# EAGLE design Bodenplatine (EAGLE 5.11)
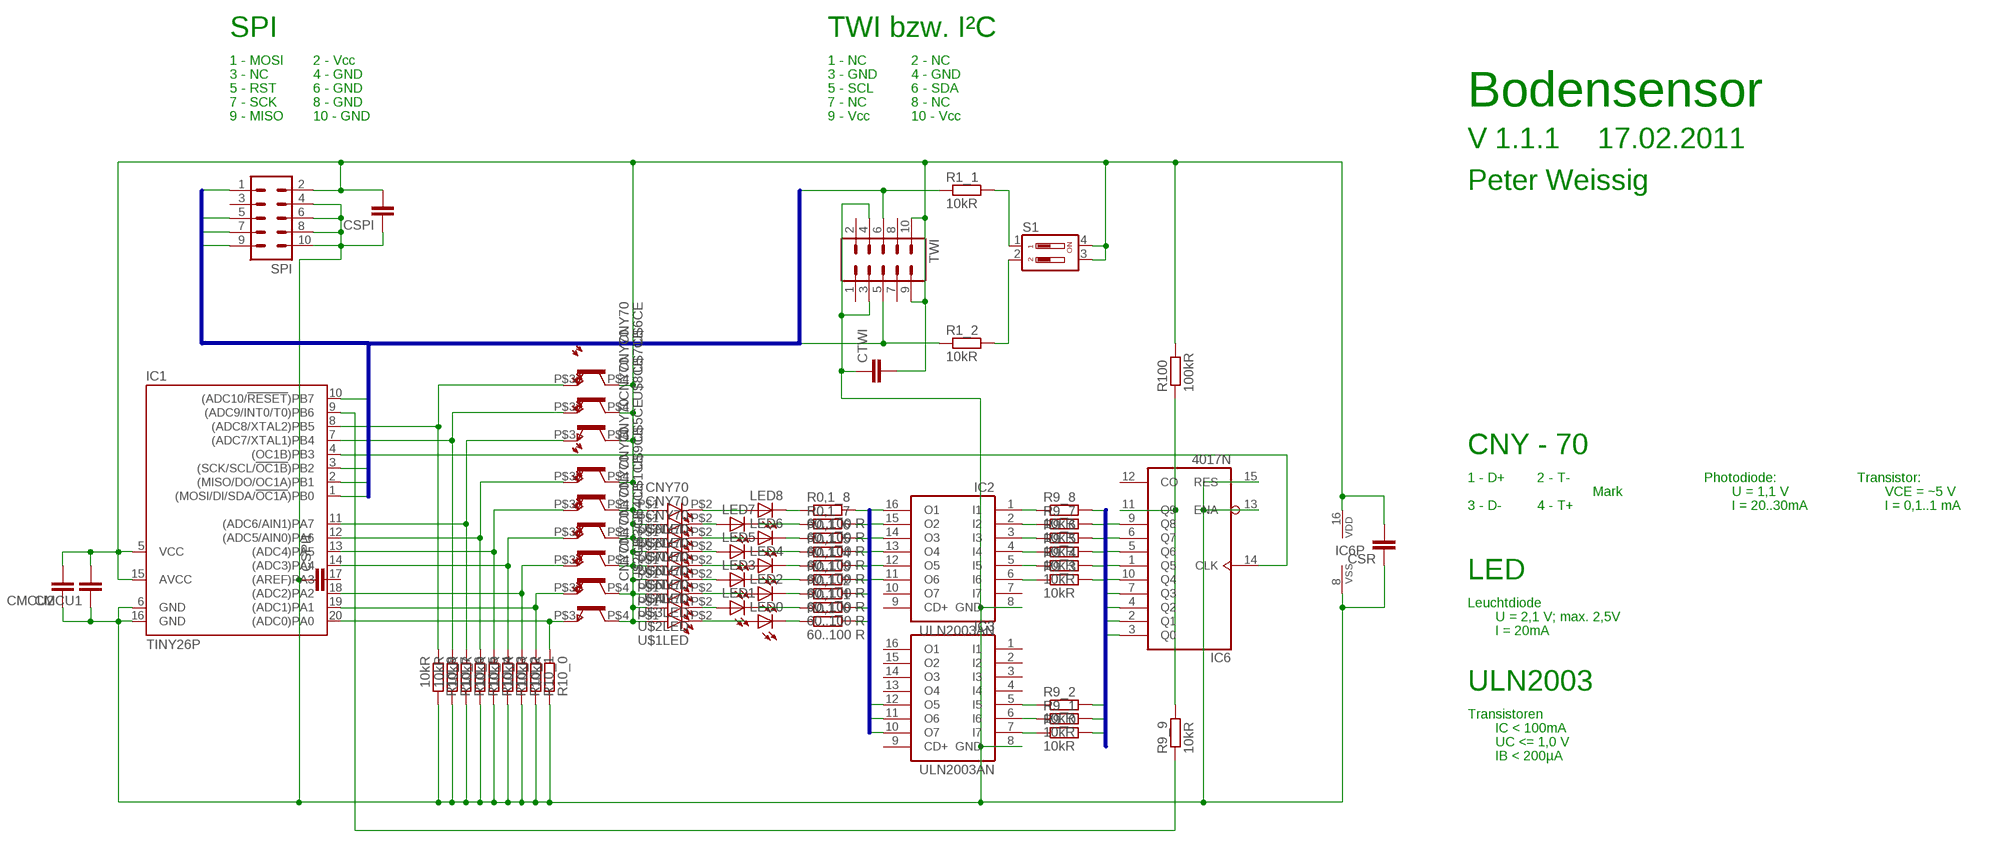
[diagram p0: schematic, sheet 1]

## Parts
CMCU1  C-EU025-025X050  [C025-025X050]
CMCU2  C-EU025-025X050  [C025-025X050]
CSPI  C-EU025-025X050  [C025-025X050]
CSPI1  C-EU025-025X050  [C025-025X050]
CSR  C-EU025-025X050  [C025-025X050]
CTWI  C-EU025-025X050  [C025-025X050]
IC1  TINY26P  [DIL20]
IC2  ULN2003AN  [DIL16]
IC3  ULN2003AN  [DIL16]
IC6  4017N  [DIL16]
LED0  LED3MM  [LED3MM]
LED1  LED3MM  [LED3MM]
LED2  LED3MM  [LED3MM]
LED3  LED3MM  [LED3MM]
LED4  LED3MM  [LED3MM]
LED5  LED3MM  [LED3MM]
LED6  LED3MM  [LED3MM]
LED7  LED3MM  [LED3MM]
LED8  LED3MM  [LED3MM]
R0,1_0  60..100 R  R-EU_0207/10  [0207/10]
R0,1_1  60..100 R  R-EU_0207/10  [0207/10]
R0,1_2  60..100 R  R-EU_0207/10  [0207/10]
R0,1_3  60..100 R  R-EU_0207/10  [0207/10]
R0,1_4  60..100 R  R-EU_0207/10  [0207/10]
R0,1_5  60..100 R  R-EU_0207/10  [0207/10]
R0,1_6  60..100 R  R-EU_0207/10  [0207/10]
R0,1_7  60..100 R  R-EU_0207/10  [0207/10]
R0,1_8  60..100 R  R-EU_0207/10  [0207/10]
R1_1  10kR  R-EU_R1206  [R1206]
R1_2  10kR  R-EU_R1206  [R1206]
R9_0  10kR  R-EU_R1206  [R1206]
R9_1  10kR  R-EU_R1206  [R1206]
R9_2  10kR  R-EU_R1206  [R1206]
R9_3  10kR  R-EU_R1206  [R1206]
R9_4  10kR  R-EU_R1206  [R1206]
R9_5  10kR  R-EU_R1206  [R1206]
R9_6  10kR  R-EU_R1206  [R1206]
R9_7  10kR  R-EU_R1206  [R1206]
R9_8  10kR  R-EU_R1206  [R1206]
R9_9  10kR  R-EU_R1206  [R1206]
R10_0  10kR  R-EU_R1206  [R1206]
R10_1  10kR  R-EU_R1206  [R1206]
R10_2  10kR  R-EU_R1206  [R1206]
R10_3  10kR  R-EU_0207/10  [0207/10]
R10_4  10kR  R-EU_0207/10  [0207/10]
R10_5  10kR  R-EU_0207/10  [0207/10]
R10_6  10kR  R-EU_R1206  [R1206]
R10_7  10kR  R-EU_R1206  [R1206]
R10_8  10kR  R-EU_R1206  [R1206]
R100  100kR  R-EU_R1206  [R1206]
S1  DIP02YL  [DIP02YL]
SPI  ML10  [ML10]
TWI  ML10  [ML10]
U$1  CNY70  [CNY70]
U$2  CNY70  [CNY70]
U$3  CNY70  [CNY70]
U$4  CNY70  [CNY70]
U$5  CNY70  [CNY70]
U$6  CNY70  [CNY70]
U$7  CNY70  [CNY70]
U$8  CNY70  [CNY70]
U$9  CNY70  [CNY70]

## Nets
B4017D0: IC6.3(Q0) R9_4.2
B4017D1: IC6.2(Q1) R9_3.2
B4017D2: IC6.4(Q2) R9_5.2
B4017D3: IC6.7(Q3) R9_8.2
B4017D4: IC6.10(Q4) R9_1.2
B4017D5: IC6.1(Q5) R9_2.2
B4017D6: IC6.5(Q6) R9_6.2
B4017D7: IC6.6(Q7) R9_7.2
B4017D8: IC6.9(Q8) R9_0.2
BSPI0: IC1.1((MOSI/DI/SDA/!OC1A!)PB0) R1_1.1 SPI.1 TWI.6
BSPI1: IC1.10((ADC10/!RESET!)PB7) SPI.5
BSPI2: IC1.3((SCK/SCL/!OC1B!)PB2) R1_2.1 SPI.7 TWI.5
BSPI3: IC1.2((MISO/DO/OC1A)PB1) SPI.9
BULN0: IC2.12(O5) R0,1_0.2
BULN1: IC2.11(O6) R0,1_1.2
BULN2: IC2.13(O4) R0,1_2.2
BULN3: IC2.16(O1) R0,1_3.2
BULN4: IC3.11(O6) R0,1_4.2
BULN5: IC3.12(O5) R0,1_5.2
BULN6: IC2.14(O3) R0,1_6.2
BULN7: IC2.15(O2) R0,1_7.2
BULN8: IC3.10(O7) R0,1_8.2
GND: CMCU1.1 CMCU2.1 CSPI1.1 CSPI.1 CSR.1 CTWI.1 IC1.6(GND) IC1.16(GND) IC2.8(GND) IC3.8(GND) IC6.8(VSS) IC6.13(ENA) IC6.15(RES) R10_0.2 R10_1.2 R10_2.2 R10_3.2 R10_4.2 R10_5.2 R10_6.2 R10_7.2 R10_8.2 SPI.4 SPI.6 SPI.8 SPI.10 TWI.3 TWI.4
N$1: IC1.20((ADC0)PA0) R10_0.1 U$2.P$3(CE:E)
N$2: LED0.A U$1.P$2(LED:K)
N$3: LED0.K(C) R0,1_0.1
N$4: LED8.A U$9.P$2(LED:K)
N$5: IC1.19((ADC1)PA1) R10_1.1 U$3.P$3(CE:E)
N$6: LED1.A U$2.P$2(LED:K)
N$7: LED1.K(C) R0,1_1.1
N$8: IC1.8((ADC8/XTAL2)PB5) R10_8.1 U$6.P$3(CE:E)
N$9: LED8.K(C) R0,1_8.1
N$10: IC3.5(I5) R9_2.1
N$11: IC1.12((ADC5/AIN0)PA6) R10_5.1 U$5.P$3(CE:E)
N$12: LED2.A U$3.P$2(LED:K)
N$13: LED2.K(C) R0,1_2.1
N$14: IC3.6(I6) R9_1.1
N$15: IC1.18((ADC2)PA2) R10_2.1 U$4.P$3(CE:E)
N$16: LED3.A U$4.P$2(LED:K)
N$17: LED3.K(C) R0,1_3.1
N$18: IC3.7(I7) R9_0.1
N$19: IC1.14((ADC3)PA4) R10_3.1 U$1.P$3(CE:E)
N$20: IC1.13((ADC4)PA5) R10_4.1 U$9.P$3(CE:E)
N$21: LED4.A U$5.P$2(LED:K)
N$22: LED4.K(C) R0,1_4.1
N$23: IC1.11((ADC6/AIN1)PA7) R10_6.1 U$8.P$3(CE:E)
N$24: LED5.A U$6.P$2(LED:K)
N$25: LED5.K(C) R0,1_5.1
N$26: CSPI1.2 IC1.17((AREF)PA3)
N$27: IC1.7((ADC7/XTAL1)PB4) R10_7.1 U$7.P$3(CE:E)
N$28: LED6.A U$7.P$2(LED:K)
N$29: LED6.K(C) R0,1_6.1
N$32: LED7.A U$8.P$2(LED:K)
N$33: LED7.K(C) R0,1_7.1
N$34: IC2.6(I6) R9_3.1
N$35: IC2.5(I5) R9_4.1
N$36: IC2.4(I4) R9_5.1
N$37: IC2.3(I3) R9_6.1
N$38: IC2.2(I2) R9_7.1
N$39: IC2.1(I1) R9_8.1
N$43: IC1.4((OC1B)PB3) IC6.14(CLK)
N$44: IC1.9((ADC9/INT0/T0)PB6) R9_9.1
N$57: IC6.11(Q9) R9_9.2 R100.1
N$58: R1_1.2 S1.1
N$59: R1_2.2 S1.2
VCC: CMCU1.2 CMCU2.2 CSPI.2 CSR.2 CTWI.2 IC1.5(VCC) IC1.15(AVCC) IC6.16(VDD) R100.2 S1.3 S1.4 SPI.2 TWI.9 TWI.10 U$1.P$1(LED:A) U$1.P$4(CE:C) U$2.P$1(LED:A) U$2.P$4(CE:C) U$3.P$1(LED:A) U$3.P$4(CE:C) U$4.P$1(LED:A) U$4.P$4(CE:C) U$5.P$1(LED:A) U$5.P$4(CE:C) U$6.P$1(LED:A) U$6.P$4(CE:C) U$7.P$1(LED:A) U$7.P$4(CE:C) U$8.P$1(LED:A) U$8.P$4(CE:C) U$9.P$1(LED:A) U$9.P$4(CE:C)
Unconnected: IC2.7(I7) IC2.9(CD+) IC2.10(O7) IC3.1(I1) IC3.2(I2) IC3.3(I3) IC3.4(I4) IC3.9(CD+) IC3.13(O4) IC3.14(O3) IC3.15(O2) IC3.16(O1) IC6.12(CO) SPI.3 TWI.1 TWI.2 TWI.7 TWI.8

## Buses
BSPI[0..3]
BULN[0..8]
B4017D[0..8]

## Notes on the sheet
- SPI | TWI bzw. I²C
- 1 - MOSI | 2 - Vcc | 1 - NC | 2 - NC
- 3 - NC | 4 - GND | 3 - GND | 4 - GND
- 5 - RST | 6 - GND | 5 - SCL | 6 - SDA
- 7 - SCK | 8 - GND | 7 - NC | 8 - NC | Bodensensor
- 9 - MISO | 10 - GND | 9 - Vcc | 10 - Vcc
- V 1.1.1 | 17.02.2011
- Peter Weissig
- CNY - 70
- 1 - D+ | 2 - T- | Photodiode: | Transistor:
- Mark | U = 1,1 V | VCE = ~5 V
- 3 - D- | 4 - T+ | I = 20..30mA | I = 0,1..1 mA
- LED
- Leuchtdiode
- U = 2,1 V; max. 2,5V
- I = 20mA
- ULN2003
- Transistoren
- IC < 100mA
- UC <= 1,0 V
- IB < 200µA

## Library data of the parts
CMCU1 CMCU2 CSPI CSPI1 CSR CTWI = rcl:C-EU: CAPACITOR, European symbol
IC1 = atmel:TINY26*: 8-bit AVR Microcontroller with 2K Bytes Flash Source: http://www.atmel.com .. doc1477.pdf
IC2 IC3 = uln-udn:ULN2003A: DRIVER ARRAY
IC6 = 40xx:4017: COUNTER/DIVIDER
LED0 LED1-LED8 = led:LED: LED OSRAM: - CHIPLED LG R971, LG N971, LY N971, LG Q971, LY Q971, LO R971, LY R971 LH N974, LH R974 LS Q976, LO Q976, LY Q976 LO Q996 - Hyper CHIPLED LW Q18S LB Q993, LB Q99A, LB R99A - SideLED LS A670, LO A670, LY A670, LG A670, LP A670 LB A673, LV A673, LT A673, LW A673 LH A674 LY A675 LS A676, LA A676, LO A676, LY A676, LW A676 LS A679, LY A679, LG A679 - Hyper Micro SIDELED® LS Y876, LA Y876, LO Y876, LY Y876 LT Y87S - SmartLED LW L88C, LW L88S LB L89C, LB L89S, LG L890 LS L89K, LO L89K, LY L89K LS L896, LA L896, LO L896, LY L896 - TOPLED LS T670, LO T670, LY T670, LG T670, LP T670 LSG T670, LSP T670, LSY T670, LOP T670, LYG T670 LG T671, LOG T671, LSG T671 LB T673, LV T673, LT T673, LW T673 LH T674 LS T676, LA T676, LO T676, LY T676, LB T676, LH T676, LSB T676, LW T676 LB T67C, LV T67C, LT T67C, LS T67K, LO T67K, LY T67K, LW E67C LS E67B, LA E67B, LO E67B, LY E67B, LB E67C, LV E67C, LT E67C LW T67C LS T679, LY T679, LG T679 LS T770, LO T770, LY T770, LG T770, LP T770 LB T773, LV T773, LT T773, LW T773 LH T774 LS E675, LA E675, LY E675, LS T675 LS T776, LA T776, LO T776, LY T776, LB T776 LHGB T686 LT T68C, LB T68C - Hyper Mini TOPLED® LB M676 - Mini TOPLED Santana® LG M470 LS M47K, LO M47K, LY M47K Source: http://www.osram.convergy.de LUXEON: - LUMILED® LXK2-PW12-R00, LXK2-PW12-S00, LXK2-PW14-U00, LXK2-PW14-V00 LXK2-PM12-R00, LXK2-PM12-S00, LXK2-PM14-U00 LXK2-PE12-Q00, LXK2-PE12-R00, LXK2-PE12-S00, LXK2-PE14-T00, LXK2-PE14-U00 LXK2-PB12-K00, LXK2-PB12-L00, LXK2-PB12-M00, LXK2-PB14-N00, LXK2-PB14-P00, LXK2-PB14-Q00 LXK2-PR12-L00, LXK2-PR12-M00, LXK2-PR14-Q00, LXK2-PR14-R00 LXK2-PD12-Q00, LXK2-PD12-R00, LXK2-PD12-S00 LXK2-PH12-R00, LXK2-PH12-S00 LXK2-PL12-P00, LXK2-PL12-Q00, LXK2-PL12-R00 Source: www.luxeon.com KINGBRIGHT: KA-3528ASYC Source: www.kingbright.com
R0,1_0 R0,1_1-R0,1_8 R1_1 R1_2 R9_0 R9_1-R9_9 R10_0 R10_1-R10_8 R100 = rcl:R-EU_: RESISTOR, European symbol
S1 = switch-dil:DIP02YL: DIL/CODE SWITCH
SPI TWI = con-harting-ml:ML10: HARTING
U$1-U$9 = optocoupler:CNY70

## Board
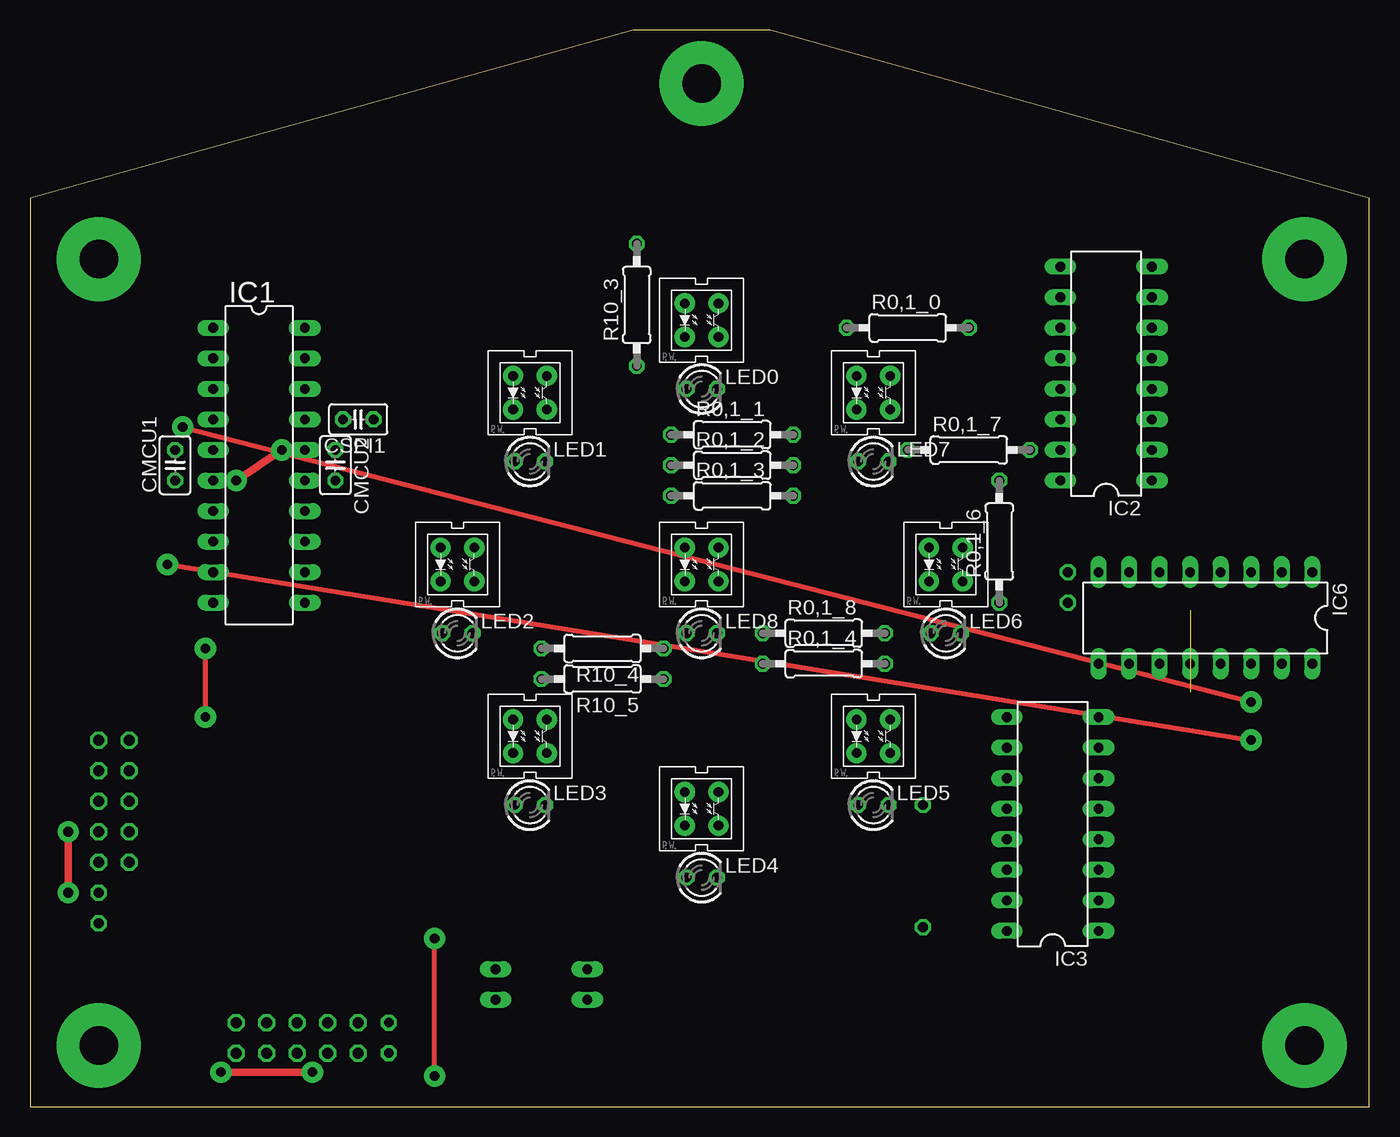
[diagram p1: board, top side]
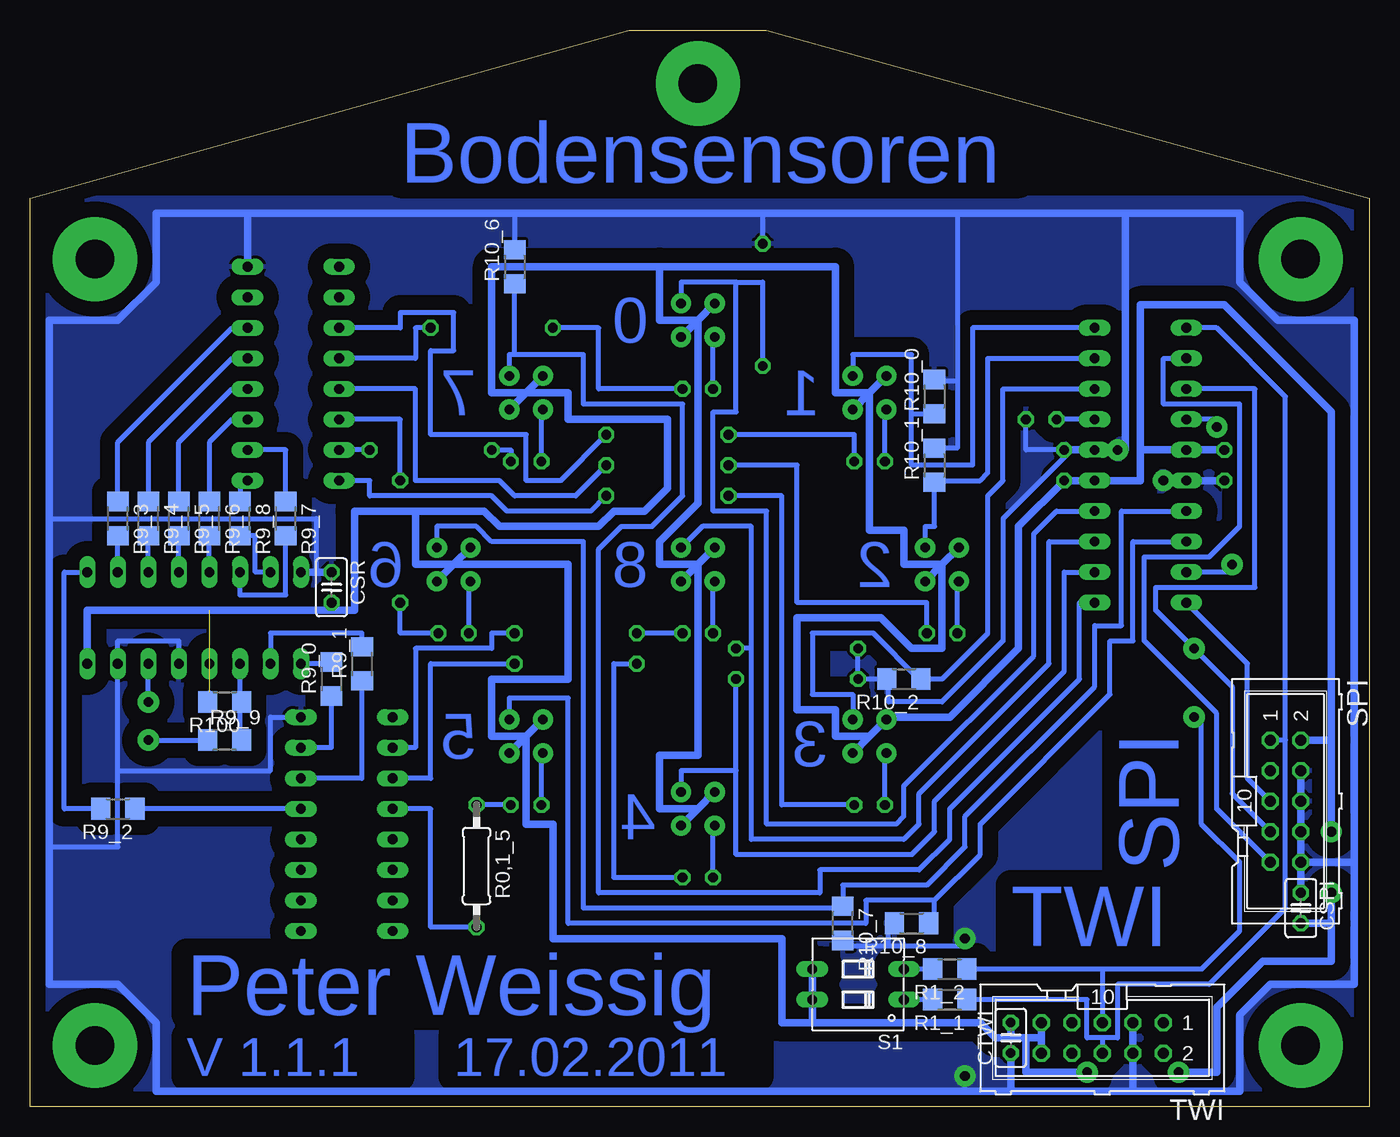
[diagram p2: board, bottom side, seen from below]

Size 111.44 x 89.53 mm. Coordinates in mm from the lower left corner, seen from the top.
Outline: 0,0 111.43,0 111.43,75.56 111.44,75.56 61.59,89.53 50.16,89.53 0,75.56 0,0
Copper layers (1*16): Top 0.035mm / dielectric 1.5mm / Bottom 0.035mm
Design rules "default": minimum track width 10mil, minimum drill 24mil, track to track 8mil, track to pad 8mil, pad to pad 8mil, via to via 8mil, smd to smd 8mil, copper to edge 40mil, drill to drill 8mil, minimum pad ring 10mil, minimum via ring 8mil, stop-mask expansion 4mil, vias tented up to drill 0mil, thermal gap 10mil

### Footprints (pad centres in the part's own frame; a part is rotated, then mirrored left to right if it is on the bottom)
C025-025X050 = drill 0.813 octagon: 1 -1.27,0; 2 1.27,0
DIL20 = drill 0.813 long: 1 -11.43,-3.81; 2 -8.89,-3.81; 3 -6.35,-3.81; 4 -3.81,-3.81; 5 -1.27,-3.81; 6 1.27,-3.81; 7 3.81,-3.81; 8 6.35,-3.81; 9 8.89,-3.81; 10 11.43,-3.81; 11 11.43,3.81; 12 8.89,3.81; 13 6.35,3.81; 14 3.81,3.81; 15 1.27,3.81; 16 -1.27,3.81; 17 -3.81,3.81; 18 -6.35,3.81; 19 -8.89,3.81; 20 -11.43,3.81
DIL16 = drill 0.813 long: 1 -8.89,-3.81; 2 -6.35,-3.81; 3 -3.81,-3.81; 4 -1.27,-3.81; 5 1.27,-3.81; 6 3.81,-3.81; 7 6.35,-3.81; 8 8.89,-3.81; 9 8.89,3.81; 10 6.35,3.81; 11 3.81,3.81; 12 1.27,3.81; 13 -1.27,3.81; 14 -3.81,3.81; 15 -6.35,3.81; 16 -8.89,3.81
LED3MM = drill 0.813 octagon: A -1.27,0; K 1.27,0
0207/10 = drill 0.813 octagon: 1 -5.08,0; 2 5.08,0
R1206 = smd 1.6 x 1.803: 1 -1.422,0; 2 1.422,0
DIP02YL = drill 0.813 long: 1 -1.27,-3.81; 2 1.27,-3.81; 3 1.27,3.81; 4 -1.27,3.81
ML10 = drill 0.914 octagon: 1 -5.08,-1.27; 2 -5.08,1.27; 3 -2.54,-1.27; 4 -2.54,1.27; 5 0,-1.27; 6 0,1.27; 7 2.54,-1.27; 8 2.54,1.27; 9 5.08,-1.27; 10 5.08,1.27
CNY70 = drill 0.8 pad 1.676 round: P$1 -1.4,1.4; P$2 -1.4,-1.4; P$3 1.4,1.4; P$4 1.4,-1.4

### Placement (x,y rotation side)
CMCU1  12.07,53.34 90 top
CMCU2  25.4,53.34 270 top
CSPI  5.71,16.51 270 bottom
CSPI1  27.3,57.15 180 top
CSR  86.36,43.18 270 bottom
CTWI  29.84,5.71 90 bottom
IC1  19.05,53.34 270 top
IC2  89.53,60.96 90 top
IC3  85.09,23.5 90 top
IC6  97.79,40.64 180 top
LED0  55.88,59.69 0 top
LED1  41.59,53.66 0 top
LED2  35.56,39.37 0 top
LED3  41.59,25.08 0 top
LED4  55.88,19.05 0 top
LED5  70.17,25.08 0 top
LED6  76.2,39.37 0 top
LED7  70.17,53.66 0 top
LED8  55.88,39.37 0 top
R0,1_0  73.02,64.77 0 top
R0,1_1  58.42,55.88 0 top
R0,1_2  58.42,53.34 0 top
R0,1_3  58.42,50.8 0 top
R0,1_4  66.04,36.83 0 top
R0,1_5  74.3,20 270 bottom
R0,1_6  80.64,46.99 90 top
R0,1_7  78.11,54.61 0 top
R0,1_8  66.04,39.37 0 top
R1_1  34.92,8.89 180 bottom
R1_2  34.92,11.43 180 bottom
R9_0  86.36,35.56 90 bottom
R9_1  83.82,36.83 90 bottom
R9_2  104.14,24.77 180 bottom
R9_3  104.14,48.9 270 bottom
R9_4  101.6,48.9 270 bottom
R9_5  99.06,48.9 270 bottom
R9_6  96.52,48.9 270 bottom
R9_7  90.17,48.9 270 bottom
R9_8  93.98,48.9 270 bottom
R9_9  95.25,30.48 0 bottom
R10_0  36.2,59.05 90 bottom
R10_1  36.2,53.34 90 bottom
R10_2  38.73,35.56 180 bottom
R10_3  50.48,66.67 90 top
R10_4  47.62,38.1 180 top
R10_5  47.62,35.56 180 top
R10_6  71.12,69.85 90 bottom
R10_7  43.81,15.24 270 bottom
R10_8  38.1,15.24 180 bottom
R100  95.25,33.66 180 bottom
S1  42.55,10.16 90 bottom
SPI  6.99,25.4 270 bottom
TWI  22.23,5.71 180 bottom
U$1  55.88,65.41 0 top
U$2  41.59,59.37 0 top
U$3  35.56,45.09 0 top
U$4  41.59,30.8 0 top
U$5  55.88,24.77 0 top
U$6  70.17,30.8 0 top
U$7  76.2,45.09 0 top
U$8  70.17,59.37 0 top
U$9  55.88,45.09 0 top

### Tracks (layer width: path | path; a pad name or v marks a point on that pad's centre or on a via)
B4017D0
  Bottom 0.406: IC6.3 R9_4.2
B4017D1
  Bottom 0.406: IC6.2 R9_3.2
B4017D2
  Bottom 0.406: IC6.4 R9_5.2
B4017D3
  Bottom 0.406: IC6.7 92.71,44.45 92.71,47.47 R9_8.2
B4017D4
  Bottom 0.406: R9_1.2 83.82,39.37 91.44,39.37 IC6.10
B4017D5
  Bottom 0.406: IC6.1 108.58,44.45 108.58,24.77 R9_2.2
B4017D6
  Bottom 0.406: IC6.5 R9_6.2
B4017D7
  Bottom 0.406: IC6.6 93.98,42.55 90.17,42.55 R9_7.2
B4017D8
  Bottom 0.406: IC6.9 86.36,36.83 R9_0.2
BSPI0
  Bottom 0.406: IC1.1 12.7,64.77 6.99,59.05 6.99,30.48 | 6.99,30.48 SPI.1 | 6.99,30.48 6.99,16.51 13.34,10.16 20.95,10.16 20.95,5.71 22.23,5.71 | R1_1.1 23.49,8.89 23.49,5.71 22.23,5.71 | 22.23,5.71 TWI.6
BSPI1
  Bottom 0.406: SPI.5 10.16,27.3 10.16,36.83 IC1.10
BSPI2  (via drill 0.8 pad 1.78)
  Top 0.406: v14.61,32.39 v14.61,38.1
  Bottom 0.406: IC1.3 9.53,59.69 9.53,43.18 17.78,43.18 17.78,41.27 v14.61,38.1 11.43,34.92 11.43,26.04 SPI.7 | v14.61,32.39 13.97,32.39 13.97,23.5 10.79,20.32 10.79,14.61 13.97,11.43 22.23,11.43 | 22.23,11.43 TWI.5 | 22.23,11.43 R1_2.1
BSPI3
  Bottom 0.406: IC1.2 17.14,62.23 17.14,58.42 10.79,58.42 10.79,48.26 13.34,45.72 18.73,45.72 18.73,38.73 12.7,32.7 12.7,24.77 SPI.9
BULN0
  Bottom 0.406: R0,1_0.2 79.38,64.77 79.38,62.23 IC2.12
BULN1
  Bottom 0.406: R0,1_1.2 67.31,52.07 70.17,52.07 70.17,55.88 78.11,55.88 78.11,62.87 76.2,62.87 76.2,66.04 80.64,66.04 80.64,64.77 IC2.11
BULN2
  Bottom 0.406: R0,1_2.2 66.04,50.8 71.12,50.8 72.39,52.07 79.38,52.07 79.38,59.69 IC2.13
BULN3
  Bottom 0.406: R0,1_3.2 64.77,49.53 71.75,49.53 73.02,50.8 83.19,50.8 83.19,52.07 IC2.16
BULN4
  Bottom 0.406: R0,1_4.2 78.11,36.83 78.11,27.3 IC3.11
BULN5
  Bottom 0.406: R0,1_5.2 78.11,14.92 78.11,24.77 IC3.12
BULN6
  Bottom 0.406: IC2.14 80.64,57.15 R0,1_6.2
BULN7
  Bottom 0.406: R0,1_7.2 IC2.15
BULN8
  Bottom 0.406: R0,1_8.2 73.02,39.37 73.02,38.1 79.38,38.1 79.38,29.84 IC3.10
GND  (via drill 0.8 pad 1.78)
  Top 0.406: v33.66,2.54 v33.66,13.97
  Top 0.61: v20.95,54.61 v17.14,52.07
  Bottom 0.406: 71.12,71.12 R10_6.2 71.12,74.29 | R10_1.2 34.29,54.76 34.29,60.33 | 34.29,60.33 36.2,60.33 R10_0.2 | R10_4.2 R10_5.2 R10_2.2 40,35.56 40,33.66 35.56,33.66 30.48,38.73 30.48,48.9 24.77,54.61 CMCU2.1 28.58,54.61 CSPI1.1 | 104.14,27.94 104.14,21.59 109.86,21.59 | 104.14,27.94 IC6.15 104.14,38.73 99.06,38.73 IC6.13 | 34.29,74.29 34.29,60.33 | IC6.8 87.63,44.45 87.63,48.9 109.86,48.9 | v33.66,13.97 33.66,13.34 40,13.34 | 33.66,1.27 v33.66,2.54 | IC3.8 91.44,32.39 91.44,27.94 104.14,27.94 | R10_8.2 40,15.24 40,13.34 | 40,13.34 43.81,13.34 R10_7.2 | R10_3.2 50.48,74.29 52.07,74.29
  Bottom 0.61: SPI.10 SPI.8 SPI.6 SPI.4 | 19.69,1.27 10.79,1.27 10.79,7.62 8.25,10.16 1.27,10.16 1.27,20.32 | 19.69,1.27 29.84,1.27 | 29.84,1.27 33.66,1.27 100.97,1.27 100.97,6.99 104.14,10.16 109.86,10.16 109.86,21.59 109.86,48.9 109.86,65.41 104.14,65.41 100.97,68.58 100.97,74.29 93.34,74.29 | 1.27,20.32 1.27,65.41 7.62,65.41 10.79,68.58 10.79,74.29 20.32,74.29 | 20.32,74.29 34.29,74.29 52.07,74.29 71.12,74.29 93.34,74.29 | CMCU2.1 IC1.16 v20.95,54.61 20.32,54.61 20.32,74.29 | CMCU1.1 IC1.6 v17.14,52.07 | 93.34,74.29 IC2.8 | IC6.8 CSR.1 | 1.27,20.32 SPI.10 | 29.84,1.27 CTWI.1 | SPI.10 CSPI.1 | TWI.3 TWI.4 19.69,1.27
  pour Bottom (isolate 1.27): 0,0 0,75.56 111.76,75.56 111.76,0
N$1
  Bottom 0.406: U$2.P$3 42.99,62.55 38.1,62.55 38.1,57.63 | 38.1,57.63 38.1,53.34 33.02,53.34 33.02,64.77 IC1.20 | 38.1,57.63 R10_0.1
N$2
  Bottom 0.406: U$1.P$2 54.61,64 LED0.A
N$3
  Bottom 0.406: LED0.K 64.14,59.69 64.14,64.77 R0,1_0.1
N$4
  Bottom 0.406: U$9.P$2 54.61,43.69 LED8.A
N$5
  Bottom 0.406: U$3.P$3 36.96,48.26 36.2,48.26 R10_1.1 36.2,52.07 32.38,52.07 31.75,52.7 31.75,62.23 IC1.19
N$6
  Bottom 0.406: U$2.P$2 40.32,57.97 LED1.A
N$7
  Bottom 0.406: R0,1_1.1 42.86,55.88 LED1.K
N$8
  Bottom 0.406: U$6.P$3 71.57,33.97 66.67,33.97 66.67,15.24 41.91,15.24 41.91,17.14 36.2,17.14 | 36.2,17.14 32.38,20.96 32.38,23.5 21.59,34.29 21.59,38.73 19.69,38.73 19.69,46.99 IC1.8 | R10_8.1 36.2,15.24 36.2,17.14
N$9
  Bottom 0.406: LED8.K R0,1_8.1
N$10
  Bottom 0.406: IC3.5 R9_2.1
N$11
  Bottom 0.406: U$5.P$3 57.28,27.94 52.7,27.94 | 52.7,27.94 52.7,20.96 38.1,20.96 36.2,22.86 36.2,25.4 25.4,36.2 25.4,44.45 IC1.12 | 52.7,27.94 R10_5.1
N$12
  Bottom 0.406: U$3.P$2 34.29,43.69 LED2.A
N$13
  Bottom 0.406: LED2.K 36.83,41.91 47.62,41.91 47.62,53.34 R0,1_2.1
N$14
  Bottom 0.406: IC3.6 83.82,27.3 R9_1.1
N$15
  Bottom 0.406: U$4.P$3 42.99,34.29 46.35,34.29 46.35,39.37 41.27,39.37 37.46,35.56 R10_2.1 35.56,35.56 31.75,39.37 31.75,50.8 30.48,52.07 30.48,59.69 IC1.18
N$16
  Bottom 0.406: U$4.P$2 40.32,29.4 LED3.A
N$17
  Bottom 0.406: LED3.K 48.89,25.08 48.89,50.8 R0,1_3.1
N$18
  Bottom 0.406: IC3.7 86.36,29.84 R9_0.1
N$19
  Bottom 0.406: U$1.P$3 57.28,68.58 52.7,68.58 | 52.7,68.58 52.7,57.79 54.61,57.79 54.61,49.53 50.16,49.53 50.16,23.5 39.37,23.5 38.73,24.13 38.73,26.67 27.94,37.47 27.94,47.62 26.03,49.53 IC1.14 | R10_3.1 50.48,68.58 52.7,68.58
N$20
  Bottom 0.406: U$9.P$3 55.5,48.26 51.43,48.26 51.43,38.1 | 51.43,38.1 51.43,22.23 38.73,22.23 37.46,23.5 37.46,26.04 26.67,36.83 26.67,46.99 IC1.13 | 51.43,38.1 R10_4.1
N$21
  Bottom 0.406: U$5.P$2 54.61,23.37 LED4.A
N$22
  Bottom 0.406: LED4.K 62.86,19.05 62.86,36.83 R0,1_4.1
N$23
  Bottom 0.406: U$8.P$3 71.57,62.55 71.12,62.55 | 71.12,62.55 65.41,62.55 65.41,58.42 57.15,58.42 57.15,50.8 59.69,48.26 62.23,48.26 64.14,46.35 64.14,17.78 45.72,17.78 45.72,19.69 37.46,19.69 34.92,22.23 34.92,24.77 24.13,35.56 24.13,41.91 IC1.11 | 71.12,62.55 R10_6.1
N$24
  Bottom 0.406: U$6.P$2 68.9,29.4 LED5.A
N$25
  Bottom 0.406: LED5.K R0,1_5.1
N$26
  Bottom 0.406: IC1.17 CSPI1.2
N$27
  Bottom 0.406: U$7.P$3 77.6,48.26 74.3,48.26 73.02,46.99 65.41,46.99 65.41,16.51 43.81,16.51 43.81,18.41 36.83,18.41 33.66,21.59 33.66,24.13 22.86,34.92 22.86,40.01 20.64,40.01 20.64,49.53 IC1.7
  Bottom 0.61: 43.81,16.51 R10_7.1
N$28
  Bottom 0.406: U$7.P$2 74.93,43.69 LED6.A
N$29
  Bottom 0.406: R0,1_6.1 80.64,39.37 LED6.K
N$31  (via drill 3.2 pad 7)
  other vias: 5.71,70.49
N$32
  Bottom 0.406: U$8.P$2 68.9,57.97 LED7.A
N$33
  Bottom 0.406: LED7.K 71.44,54.61 R0,1_7.1
N$34
  Bottom 0.406: IC2.6 94.61,64.77 104.14,55.24 R9_3.1
N$35
  Bottom 0.406: IC2.5 94.61,62.23 101.6,55.24 R9_4.1
N$36
  Bottom 0.406: IC2.4 94.61,59.69 99.06,55.24 R9_5.1
N$37
  Bottom 0.406: IC2.3 94.61,57.15 96.52,55.24 R9_6.1
N$38
  Bottom 0.406: IC2.2 90.17,54.61 R9_7.1
N$39
  Bottom 0.406: IC2.1 93.98,52.07 R9_8.1
N$40  (via drill 3.2 pad 7)
  other vias: 55.88,85.09
N$41  (via drill 3.2 pad 7)
  other vias: 5.71,5.08
N$42  (via drill 3.2 pad 7)
  other vias: 106.05,70.49
N$43  (via drill 0.8 pad 1.78)
  Top 0.406: v12.7,56.52 v101.6,33.66
  Bottom 0.406: v101.6,33.66 IC6.14 | IC1.4 12.7,57.15 v12.7,56.52
N$44  (via drill 0.8 pad 1.78)
  Top 0.406: v11.43,45.09 v101.6,30.48
  Bottom 0.406: v101.6,30.48 R9_9.1 | v11.43,45.09 11.43,44.45 IC1.9
N$45  (via drill 3.2 pad 7)
  other vias: 106.05,5.08
N$57
  Bottom 0.406: 93.98,34.29 93.98,31.27 R9_9.2 | 93.98,34.29 IC6.11 | 93.98,34.29 R100.1
N$58
  Bottom 0.406: R1_1.2 S1.1
N$59
  Bottom 0.406: R1_2.2 S1.2
VCC  (via drill 0.8 pad 1.78)  (1 unrouted)
  Top 0.61: v3.17,17.78 v3.17,22.86 | v15.88,2.86 v23.49,2.86
  Bottom 0.406: U$6.P$4 71.75,29.4 | R100.2 96.52,34.44
  Bottom 0.61: 41.59,59.37 U$2.P$4 | 41.59,59.37 U$2.P$1 | 35.56,45.09 U$3.P$4 | 35.56,45.09 U$3.P$1 | 55.88,45.09 U$9.P$4 | 55.88,45.09 U$9.P$1 | 55.88,65.41 U$1.P$4 | 55.88,65.41 U$1.P$1 | 70.17,59.37 U$8.P$4 | 70.17,59.37 U$8.P$1 | 76.2,45.09 U$7.P$4 | 76.2,45.09 U$7.P$1 | 70.17,30.8 U$6.P$4 | 70.17,30.8 U$6.P$1 | 55.88,24.77 U$5.P$4 | 55.88,24.77 U$5.P$1 | 41.59,30.8 U$4.P$1 40,32.39 34.92,32.39 29.21,38.1 29.21,48.26 CMCU2.2 IC1.15 19.05,52.07 19.05,54.61 | 41.59,30.8 44.45,30.8 44.45,33.02 47.62,33.02 47.62,40.64 40.64,40.64 38.1,38.1 35.56,38.1 35.56,45.09 | 35.56,45.09 38.73,45.09 38.73,47.94 41.59,47.94 41.59,59.37 | 55.88,24.77 59.05,24.77 59.05,29.21 55.88,29.21 55.88,45.09 | 55.88,45.09 59.05,45.09 59.05,46.99 55.88,50.16 55.88,65.41 | 55.88,65.41 59.05,65.41 59.05,69.85 | 59.05,69.85 44.45,69.85 44.45,59.37 41.59,59.37 | 70.17,30.8 73.02,30.8 73.02,35.56 66.67,35.56 66.67,45.09 76.2,45.09 | 76.2,45.09 79.38,45.09 79.38,49.53 | 70.17,59.37 73.02,59.37 73.02,69.85 59.05,69.85 | 79.38,49.53 73.66,49.53 72.39,48.26 64.14,48.26 62.86,49.53 60.32,49.53 58.42,51.44 58.42,57.15 66.67,57.15 66.67,59.37 70.17,59.37 | 27.3,5.71 TWI.9 | 27.3,5.71 TWI.10 | CMCU1.2 IC1.5 19.05,54.61 | 41.59,30.8 U$4.P$4 | IC6.16 106.68,41.27 96.52,41.27 86.36,41.27 | 86.36,41.27 CSR.2 | 79.38,49.53 84.45,49.53 84.45,41.27 86.36,41.27 | 70.17,30.8 70.17,23.5 67.95,23.5 67.95,13.97 48.89,13.97 48.89,6.99 46.35,6.99 | 3.17,30.48 SPI.2 | 3.17,30.48 3.17,57.79 12.07,66.67 19.05,66.67 19.05,54.61 | v3.17,22.86 3.17,30.48 | 3.17,15.24 3.17,12.07 8.89,12.07 12.7,8.26 12.7,2.86 v15.88,2.86 | 3.17,15.24 v3.17,17.78 | 3.17,15.24 CSPI.2 | S1.3 S1.4 46.35,6.99
  Bottom 0.61: 46.35,6.99 32.38,6.99 31.12,5.71 29.84,5.71 | v23.49,2.86 28.58,2.86 28.58,5.71 | 28.58,5.71 27.3,5.71 | 28.58,5.71 29.84,5.71 | 29.84,5.71 CTWI.2

### Text on the board
Bottom: Bodensensoren | 0 | 1 | 7 | 2 | 8 | 6 | SPI | 3 | 5 | 4 | TWI | Peter Weissig | 17.02.2011 | V 1.1.1